# Altium schematic sheet 06_EEPROM.SchDoc
size A4
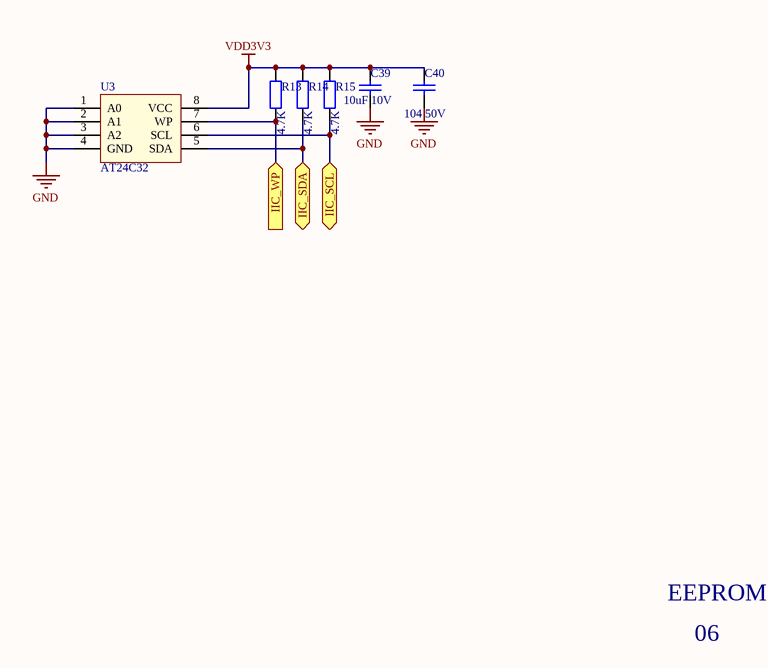
[diagram p0: 06_EEPROM.SchDoc]

## Parts
C39  10uF 10V  [SMD-0603C]
C40  104 50V  [SMD-0603C]
R13  4.7K  [SMD-0603]
R14  4.7K  [SMD-0603]
R15  4.7K  [SMD-0603]
U3  AT24C32  [SOIC-8]

## Ports
IIC_SCL (bidir), IIC_SDA (bidir), IIC_WP (in)

## Nets
GND: C39.1 C40.1 U3.1(A0) U3.2(A1) U3.3(A2) U3.4(GND)
VDD3V3: C39.2 C40.2 R13.1 R14.1 R15.1 U3.8(VCC)
IIC_SCL: R15.2 U3.6(SCL) ; port IIC_SCL
IIC_SDA: R14.2 U3.5(SDA) ; port IIC_SDA
IIC_WP: R13.2 U3.7(WP) ; port IIC_WP

## Notes on the sheet
- EEPROM
- 06

## Library data of the parts
C39 C40 = CAP4: 贴片电容 20%
R13-R15 = RES2: 贴片电阻 5%
U3 = EEPROM